# Altium schematic sheet PS_linear.SchDoc
size A4
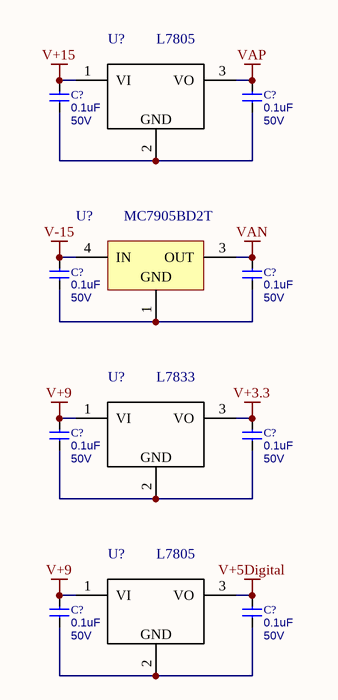
[diagram p0: PS_linear.SchDoc]

## Parts
(Parts that share a designator on the sheet are numbered #1, #2 ... from top to bottom, then left to right.)
C?#1  Capacitance: 0.1uF  Voltage: 50V  [C_1206]
C?#2  Capacitance: 0.1uF  Voltage: 50V  [C_1206]
C?#3  Capacitance: 0.1uF  Voltage: 50V  [C_1206]
C?#4  Capacitance: 0.1uF  Voltage: 50V  [C_1206]
C?#5  Capacitance: 0.1uF  Voltage: 50V  [C_1206]
C?#6  Capacitance: 0.1uF  Voltage: 50V  [C_1206]
C?#7  Capacitance: 0.1uF  Voltage: 50V  [C_1206]
C?#8  Capacitance: 0.1uF  Voltage: 50V  [C_1206]
U?#1  L7805  [D2PAK]
U?#2  MC7905BD2T  [936-03]
U?#3  L7833  [D2PAK]
U?#4  L7805  [D2PAK]

## Nets
V+3.3: C?#6.2 U?#3.3(VO)
V+5Digital: C?#8.2 U?#4.3(VO)
V+9: C?#5.2 C?#7.2 U?#3.1(VI) U?#4.1(VI)
V+15: C?#1.2 U?#1.1(VI)
V-15: C?#3.2 U?#2.4(IN)
VAN: C?#4.2 U?#2.3(OUT)
VAP: C?#2.2 U?#1.3(VO)
NetC?#1_1: C?#1.1 C?#2.1 U?#1.2
NetC?#3_1: C?#3.1 C?#4.1 U?#2.1(GND)
NetC?#5_1: C?#5.1 C?#6.1 U?#3.2
NetC?#7_1: C?#7.1 C?#8.1 U?#4.2

## Notes on the sheet
- (in symbol L7805-D2PAK) GND

## Library data of the parts
C?#1-C?#8 = C_SMD_ceramic: Capacitor
U?#1 U?#3 U?#4 = L7805-D2PAK: LINEAR REGULATOR 5.0V; Supplier 1: Digi-Key; Supplier Part Number 1: 497-1170-6-ND
U?#2 = MC7905BD2T: Three-Terminal Negative Voltage Regulator; Note: Pin 4 is TAB; Pin 2 is trimmed; Published: 15-Apr-2002; DatasheetVersion: 1996; PackageVersion: 1997; PackageReference: 936-03; Publisher: Altium Limited; PackageDescription: D2-PAK/TO-263-AB; 3 Leads (1 Cropped); Body 14.7 (inc. leads) x 10.2 mm (LxW max); ComponentLink1Description: Manufacturer Link; ComponentLink1URL: http://www.onsemi.com/site/products/taxonomy/0,4438,503,00.html; ComponentLink2Description: Datasheet; ComponentLink2URL: http://www.onsemi.com/pub/Collateral/MC7900-D.PDF